# EAGLE design PCB_triggerELP (EAGLE 7.7.0)
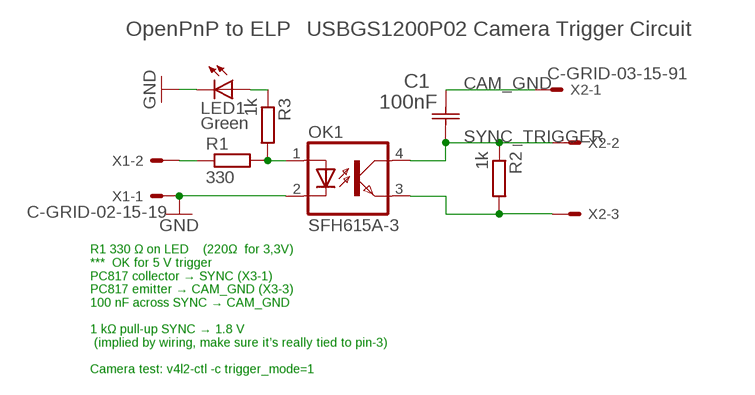
[diagram p0: schematic, sheet 1]

## Parts
C1  100nF  0805YC474MA72A  [CAPC2012X140N]
LED1  Green  LEDCHIP-LED0603  [CHIP-LED0603]
OK1  SFH615A-3  SFH6186-3  [SMD4-7]
R1  330  R-EU_R0603  [R0603]
R2  1k  R-EU_R0603  [R0603]
R3  1k  R-EU_R0603  [R0603]
X1  C-GRID-02-15-19  [15-91-02]
X2  C-GRID-03-15-91  [15-91-03]

## Nets
CAM_GND: C1.2(C2) X2.1
GND: LED1.C OK1.2(C) X1.1
N$1: OK1.1(A) R1.2 R3.2
N$2: OK1.3(EMIT) R2.2 X2.3
N$3: LED1.A R3.1
SYNC_TRIGGER: C1.1(C1) OK1.4(COL) R2.1 X2.2
TRIGGER_IN: R1.1 X1.2

## Notes on the sheet
- OpenPnP to ELP‑USBGS1200P02 Camera Trigger Circuit
- R1 330 Ω on LED    (220Ω  for 3,3V)
  ***  OK for 5 V trigger
  PC817 collector → SYNC (X3-1)
  PC817 emitter → CAM_GND (X3-3)
  100 nF across SYNC → CAM_GND
  
  1 kΩ pull-up SYNC → 1.8 V
   (implied by wiring, make sure it’s really tied to pin-3)
  
  Camera test: v4l2-ctl -c trigger_mode=1

## Library data of the parts
C1 = AVX_By_element14_Batch_1:0805YC474MA72A: Capacitor 0805; MPN: 0805YC474MA72A; OC_FARNELL: -; OC_NEWARK: 55J5507; SUPPLIER: AVX; TOLERANCE: ±20%; VALUE: 0.47UF; VOLTAGERATING: 16V
LED1 = led:LED: LED OSRAM: - CHIPLED LG R971, LG N971, LY N971, LG Q971, LY Q971, LO R971, LY R971 LH N974, LH R974 LS Q976, LO Q976, LY Q976 LO Q996 - Hyper CHIPLED LW Q18S LB Q993, LB Q99A, LB R99A - SideLED LS A670, LO A670, LY A670, LG A670, LP A670 LB A673, LV A673, LT A673, LW A673 LH A674 LY A675 LS A676, LA A676, LO A676, LY A676, LW A676 LS A679, LY A679, LG A679 - Hyper Micro SIDELED® LS Y876, LA Y876, LO Y876, LY Y876 LT Y87S - SmartLED LW L88C, LW L88S LB L89C, LB L89S, LG L890 LS L89K, LO L89K, LY L89K LS L896, LA L896, LO L896, LY L896 - TOPLED LS T670, LO T670, LY T670, LG T670, LP T670 LSG T670, LSP T670, LSY T670, LOP T670, LYG T670 LG T671, LOG T671, LSG T671 LB T673, LV T673, LT T673, LW T673 LH T674 LS T676, LA T676, LO T676, LY T676, LB T676, LH T676, LSB T676, LW T676 LB T67C, LV T67C, LT T67C, LS T67K, LO T67K, LY T67K, LW E67C LS E67B, LA E67B, LO E67B, LY E67B, LB E67C, LV E67C, LT E67C LW T67C LS T679, LY T679, LG T679 LS T770, LO T770, LY T770, LG T770, LP T770 LB T773, LV T773, LT T773, LW T773 LH T774 LS E675, LA E675, LY E675, LS T675 LS T776, LA T776, LO T776, LY T776, LB T776 LHGB T686 LT T68C, LB T68C - Hyper Mini TOPLED® LB M676 - Mini TOPLED Santana® LG M470 LS M47K, LO M47K, LY M47K Source: http://www.osram.convergy.de LUXEON: - LUMILED® LXK2-PW12-R00, LXK2-PW12-S00, LXK2-PW14-U00, LXK2-PW14-V00 LXK2-PM12-R00, LXK2-PM12-S00, LXK2-PM14-U00 LXK2-PE12-Q00, LXK2-PE12-R00, LXK2-PE12-S00, LXK2-PE14-T00, LXK2-PE14-U00 LXK2-PB12-K00, LXK2-PB12-L00, LXK2-PB12-M00, LXK2-PB14-N00, LXK2-PB14-P00, LXK2-PB14-Q00 LXK2-PR12-L00, LXK2-PR12-M00, LXK2-PR14-Q00, LXK2-PR14-R00 LXK2-PD12-Q00, LXK2-PD12-R00, LXK2-PD12-S00 LXK2-PH12-R00, LXK2-PH12-S00 LXK2-PL12-P00, LXK2-PL12-Q00, LXK2-PL12-R00 Source: www.luxeon.com KINGBRIGHT: KA-3528ASYC Source: www.kingbright.com
OK1 = optocoupler:SFH618?*: Optocoupler, Phototransistor Output, Low Input Current Source: Data sheet <http://www.vishay.com/docs/83673/sfh618.pdf>; MF: VISHAY/TELEFUNKEN; MPN: SFH6186-3; OC_FARNELL: 1469529; OC_NEWARK: 21H7751
R1-R3 = dual_atari:R-EU_: RESISTOR, European symbol
X1 = con-molex:C-GRID-02: CONNECTOR wire to board 2.54 mm (0.100") pitch header; OC_FARNELL: unknown; OC_NEWARK: unknown
X2 = con-molex:C-GRID-03: CONNECTOR wire to board 2.54 mm (0.100") pitch header; OC_FARNELL: unknown; OC_NEWARK: unknown

## Board
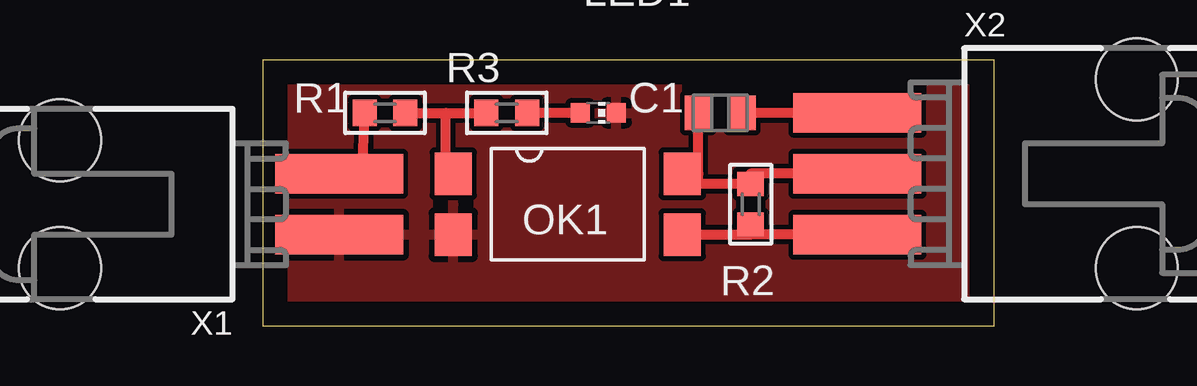
[diagram p1: board, top side]

Size 30.46 x 11.1 mm. Coordinates in mm from the lower left corner, seen from the top.
Outline: 0,0 30.46,0 30.46,11.1 0,11.1 0,0
Copper layers (1*16): Top 0.035mm / dielectric 1.5mm / Bottom 0.035mm
Design rules "default": minimum track width 10mil, minimum drill 24mil, track to track 8mil, track to pad 8mil, pad to pad 8mil, via to via 8mil, smd to smd 8mil, copper to edge 40mil, drill to drill 8mil, minimum pad ring 10mil, minimum via ring 8mil, stop-mask expansion 4mil, vias tented up to drill 0mil, thermal gap 10mil

### Footprints (pad centres in the part's own frame; a part is rotated, then mirrored left to right if it is on the bottom)
CAPC2012X140N = smd 1.118 x 1.448: 1 -0.914,0; 2 0.914,0
CHIP-LED0603 = smd 0.8 x 0.8: A 0,-0.75; C 0,0.75
SMD4-7 = smd 1.78 x 1.55: 1 -1.27,-4.77; 2 1.27,-4.77; 3 1.27,4.77; 4 -1.27,4.77
R0603 = smd 1 x 1.1: 1 -0.85,0; 2 0.85,0
15-91-02 = smd 1.651 x 5.334: 1 -1.27,-10.795; 2 1.27,-10.795 | hole 3.404: -2.667,0.838; 2.667,0.838
15-91-03 = smd 1.651 x 5.334: 1 -2.54,-10.795; 2 0,-10.795; 3 2.54,-10.795 | hole 3.404: -3.937,0.838; 3.937,0.838

### Placement (x,y rotation side)
C1  19.05,8.89 0 top
LED1  13.97,8.89 270 top
OK1  12.7,5.08 270 top
R1  5.08,8.89 0 top
R2  20.32,5.08 270 top
R3  10.16,8.89 180 top
X1  -7.62,5.08 90 top
X2  35.56,6.35 270 top

### Tracks (layer width: path | path; a pad name or v marks a point on that pad's centre or on a via)
CAM_GND
  Top 0.406: X2.1 C1.2
GND
  pour Top: 31.75,12.7 -1.27,12.7 -1.27,-1.27 31.75,-1.27
N$1
  Top 0.406: OK1.1 7.62,6.35 7.62,8.89 | 7.62,8.89 R3.2 | R1.2 7.62,8.89
N$2
  Top 0.406: OK1.3 20.32,3.81 | X2.3 20.32,3.81 | 20.32,3.81 R2.2
N$3
  Top 0.406: LED1.A R3.1
SYNC_TRIGGER
  Top 0.406: OK1.4 18.14,6.35 | 18.14,6.35 C1.1 | 18.14,6.35 18.14,5.93 R2.1 20.32,6.35 X2.2
TRIGGER_IN
  Top 0.406: X1.2 4.13,6.35 R1.1